# EAGLE design TestV1.0 (EAGLE 8.2.2)
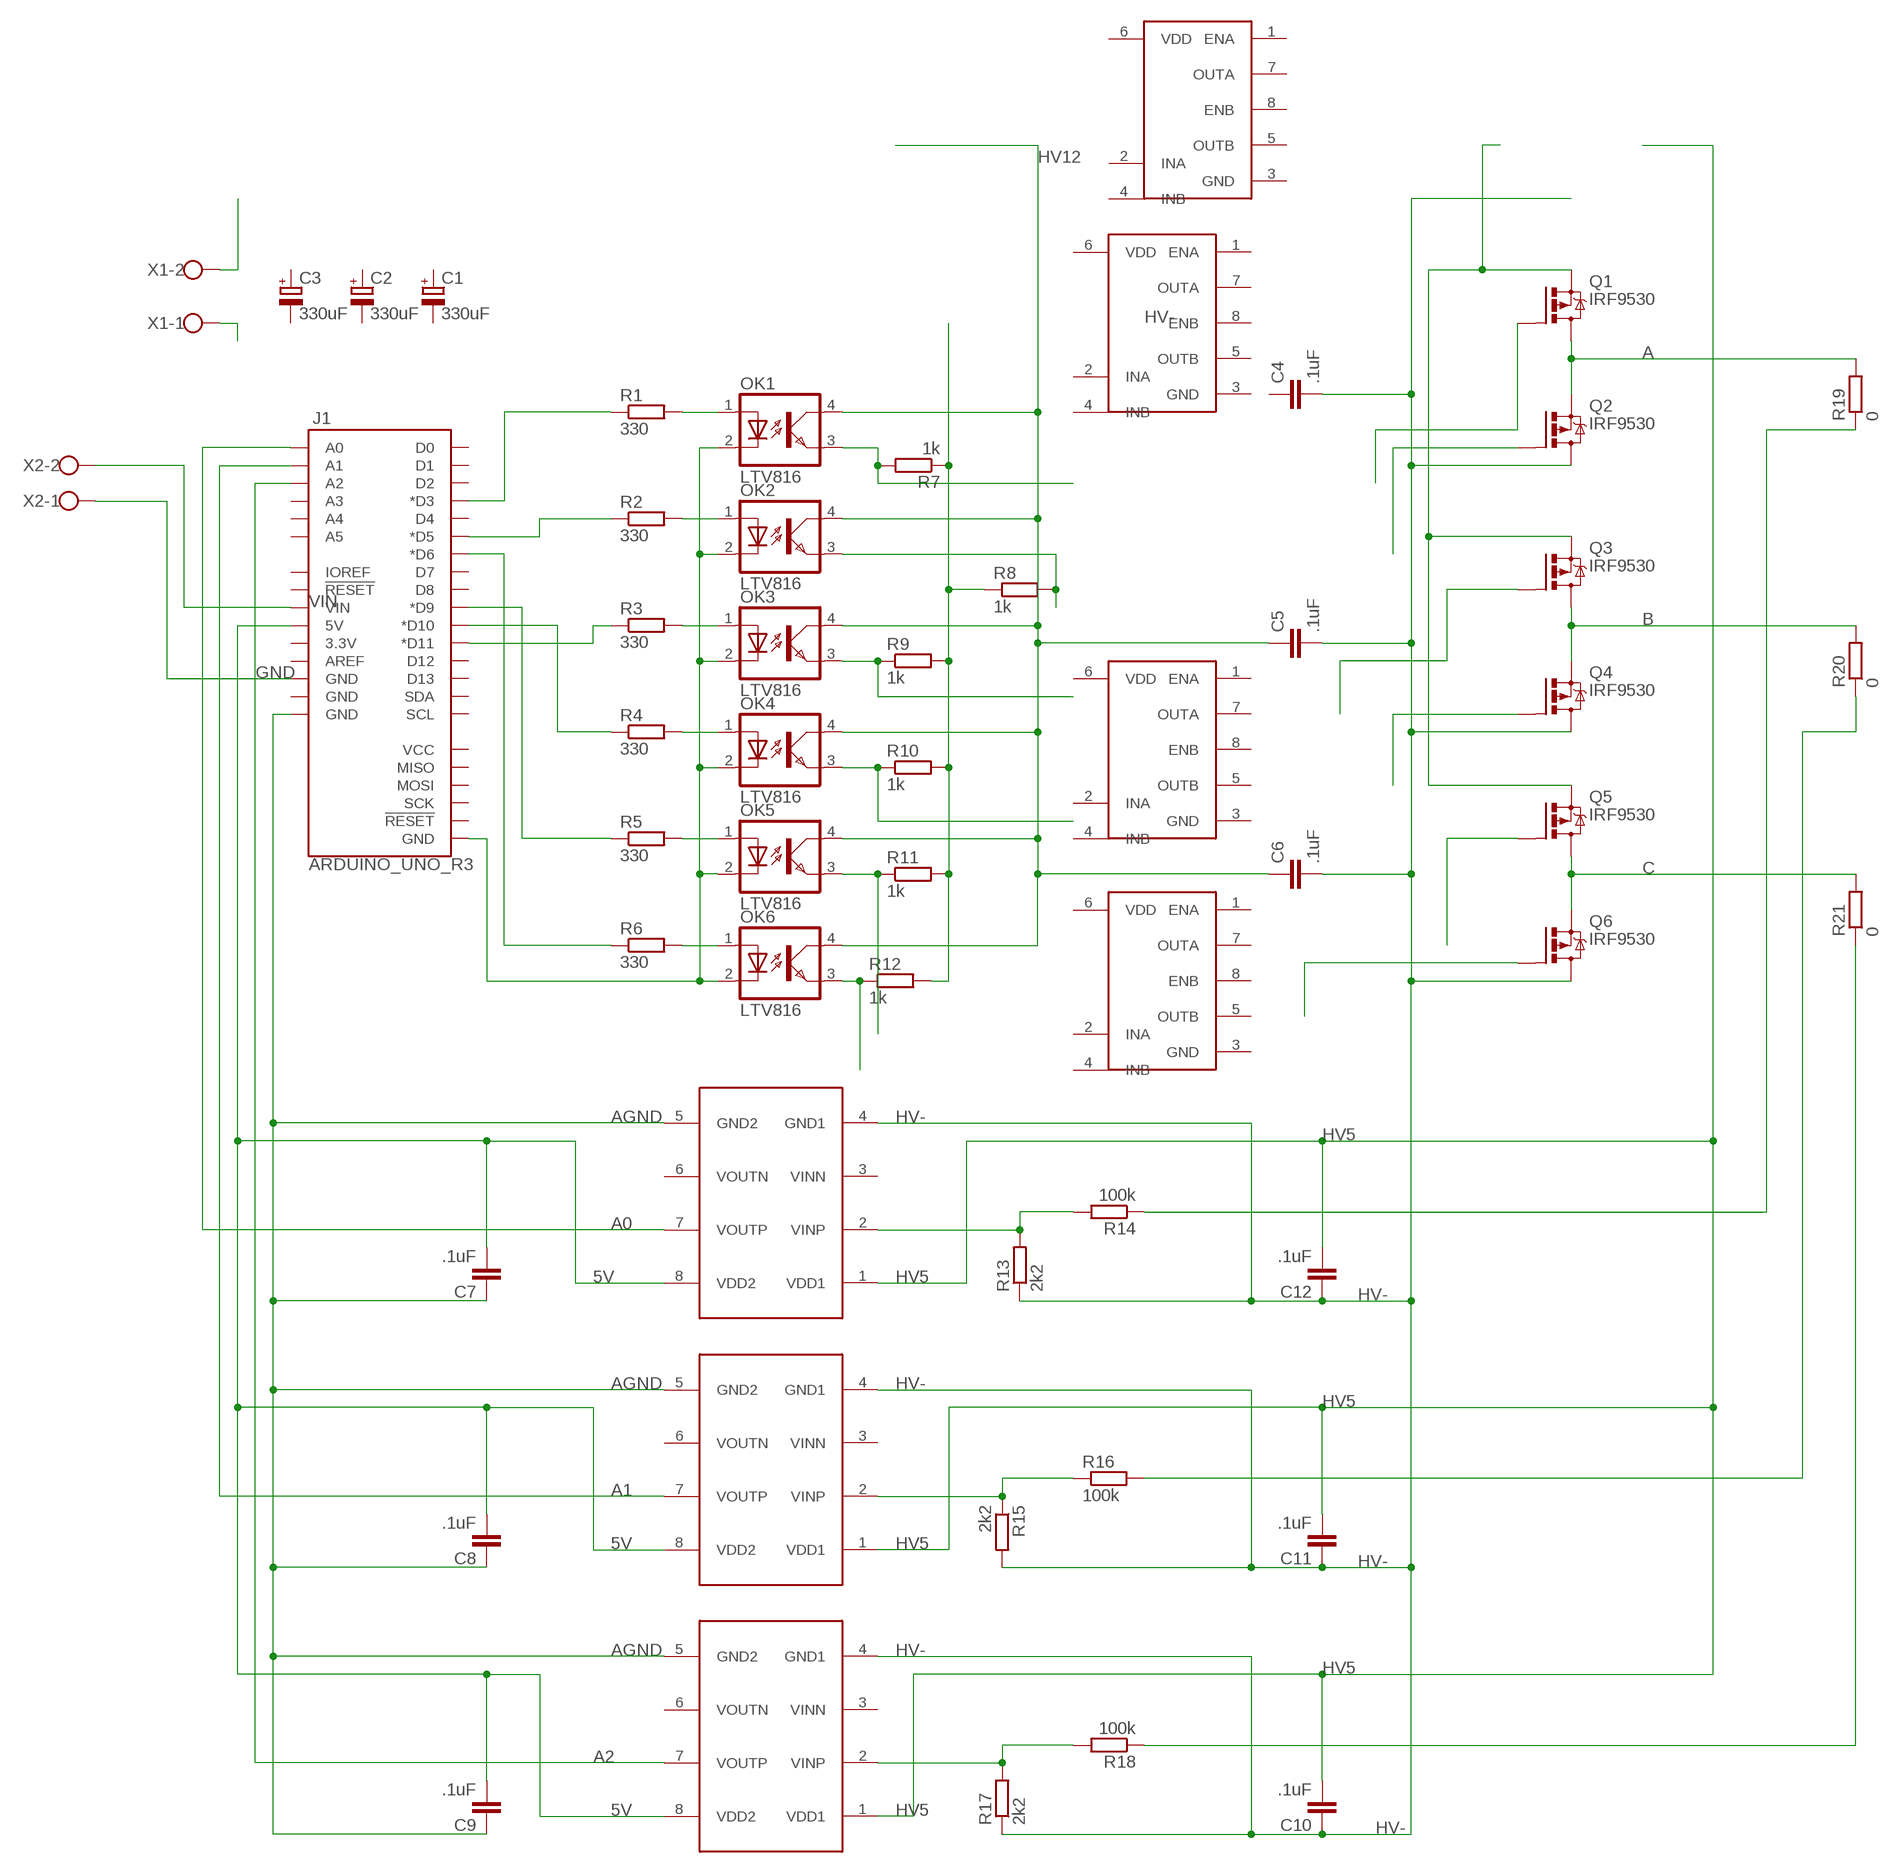
[diagram p0: schematic, sheet 1]

## Parts
C1  330uF  CPOL-EUE5-13  [E5-13]
C2  330uF  CPOL-EUE5-13  [E5-13]
C3  330uF  CPOL-EUE5-13  [E5-13]
C4  .1uF  C-EUC0603  [C0603]
C5  .1uF  C-EUC0603  [C0603]
C6  .1uF  C-EUC0603  [C0603]
C7  .1uF  C-EUC0603  [C0603]
C8  .1uF  C-EUC0603  [C0603]
C9  .1uF  C-EUC0603  [C0603]
C10  .1uF  C-EUC0603  [C0603]
C11  .1uF  C-EUC0603  [C0603]
C12  .1uF  C-EUC0603  [C0603]
J1  ARDUINO_UNO_R3  [ARDUINO_R3]
MAX17604_A  MAX17604  [SO08]
MAX17604_B  MAX17604  [SO08]
MAX17604_C  MAX17604  [SO08]
MAX17604_D  MAX17604  [SO08]
OK1  LTV816  [DIL04]
OK2  LTV816  [DIL04]
OK3  LTV816  [DIL04]
OK4  LTV816  [DIL04]
OK5  LTV816  [DIL04]
OK6  LTV816  [DIL04]
Q1  IRF9530  [TO220BV]
Q2  IRF9530  [TO220BV]
Q3  IRF9530  [TO220BV]
Q4  IRF9530  [TO220BV]
Q5  IRF9530  [TO220BV]
Q6  IRF9530  [TO220BV]
R1  330  RR0603  [R0603]
R2  330  RR0603  [R0603]
R3  330  RR0603  [R0603]
R4  330  RR0603  [R0603]
R5  330  RR0603  [R0603]
R6  330  RR0603  [R0603]
R7  1k  RR0603  [R0603]
R8  1k  RR0603  [R0603]
R9  1k  RR0603  [R0603]
R10  1k  RR0603  [R0603]
R11  1k  RR0603  [R0603]
R12  1k  RR0603  [R0603]
R13  2k2  RR0603  [R0603]
R14  100k  RR0603  [R0603]
R15  2k2  RR0603  [R0603]
R16  100k  RR0603  [R0603]
R17  2k2  RR0603  [R0603]
R18  100k  RR0603  [R0603]
R19  0  RR0603  [R0603]
R20  0  RR0603  [R0603]
R21  0  RR0603  [R0603]
U$7  AMC1200  [SO08]
U$8  AMC1200  [SO08]
U$9  AMC1200  [SO08]
X1  SCREWCONNECTOR  [2PIN-SCREW-TERMINAL]
X2  SCREWCONNECTOR  [2PIN-SCREW-TERMINAL]

## Nets
5V: C7.2 C8.2 C9.2 J1.5V U$7.8(VDD2) U$8.8(VDD2) U$9.8(VDD2)
A: Q1.D Q2.S R19.2
A0: J1.A0 U$7.7(VOUTP)
A1: J1.A1 U$8.7(VOUTP)
A2: J1.A2 U$9.7(VOUTP)
A_MINOR: R14.1 R19.1
AGND: C7.1 C8.1 C9.1 J1.GND@2(GND) U$7.5(GND2) U$8.5(GND2) U$9.5(GND2)
B: Q3.D Q4.S R20.2
B_MINOR: R16.2 R20.1
C: Q5.D Q6.S R21.2
C_MINOR: R18.1 R21.1
GND: J1.GND@4(GND) X2.1
HV5: C10.2 C11.2 C12.2 U$7.1(VDD1) U$8.1(VDD1) U$9.1(VDD1)
HV12: C5.1 C6.1 OK1.4(COL) OK2.4(COL) OK3.4(COL) OK4.4(COL) OK5.4(COL) OK6.4(COL)
HV+: Q1.S Q3.S Q5.S
HV-: C4.2 C5.2 C6.2 C10.1 C11.1 C12.1 Q2.D Q4.D Q6.D R13.1 R15.2 R17.1 U$7.4(GND1) U$8.4(GND1) U$9.4(GND1)
N$1: Q1.G
N$2: Q2.G
N$6: Q3.G
N$7: Q4.G
N$8: Q5.G
N$9: Q6.G
N$10: OK1.3(EMIT) R7.2
N$11: OK2.3(EMIT) R8.2
N$12: OK3.3(EMIT) R9.1
N$13: OK4.3(EMIT) R10.1
N$14: OK5.3(EMIT) R11.1
N$15: OK6.3(EMIT) R12.1
N$16: OK1.1(A) R1.2
N$17: J1.D3(*D3) R1.1
N$18: J1.GND@1(GND) OK1.2(C) OK2.2(C) OK3.2(C) OK4.2(C) OK5.2(C) OK6.2(C)
N$19: OK6.1(A) R6.2
N$20: OK5.1(A) R5.2
N$21: OK4.1(A) R4.2
N$22: OK3.1(A) R3.2
N$23: OK2.1(A) R2.2
N$24: J1.D5(*D5) R2.1
N$25: J1.D10(*D10) R4.1
N$26: J1.D11(*D11) R3.1
N$27: J1.D9(*D9) R5.1
N$28: J1.D6(*D6) R6.1
N$30: X1.2
N$31: R13.2 R14.2 U$7.2(VINP)
N$32: R15.1 R16.1 U$8.2(VINP)
N$33: R17.2 R18.2 U$9.2(VINP)
N$36: R7.1 R8.1 R9.2 R10.2 R11.2 R12.2
N$38: X1.1
VIN: J1.VIN X2.2
Unconnected: C1.+ C1.- C2.+ C2.- C3.+ C3.- C4.1 J1.3.3V J1.A3 J1.A4 J1.A5 J1.AREF J1.D0 J1.D1 J1.D2 J1.D4 J1.D7 J1.D8 J1.D12 J1.D13 J1.GND@3(GND) J1.IOREF J1.MISO J1.MOSI J1.RESET@1(!RESET!) J1.RESET@2(!RESET!) J1.SCK J1.SCL J1.SDA J1.VCC MAX17604_A.1(ENA) MAX17604_A.2(INA) MAX17604_A.3(GND) MAX17604_A.4(INB) MAX17604_A.5(OUTB) MAX17604_A.6(VDD) MAX17604_A.7(OUTA) MAX17604_A.8(ENB) MAX17604_B.1(ENA) MAX17604_B.2(INA) MAX17604_B.3(GND) MAX17604_B.4(INB) MAX17604_B.5(OUTB) MAX17604_B.6(VDD) MAX17604_B.7(OUTA) MAX17604_B.8(ENB) MAX17604_C.1(ENA) MAX17604_C.2(INA) MAX17604_C.3(GND) MAX17604_C.4(INB) MAX17604_C.5(OUTB) MAX17604_C.6(VDD) MAX17604_C.7(OUTA) MAX17604_C.8(ENB) MAX17604_D.1(ENA) MAX17604_D.2(INA) MAX17604_D.3(GND) MAX17604_D.4(INB) MAX17604_D.5(OUTB) MAX17604_D.6(VDD) MAX17604_D.7(OUTA) MAX17604_D.8(ENB) U$7.3(VINN) U$7.6(VOUTN) U$8.3(VINN) U$8.6(VOUTN) U$9.3(VINN) U$9.6(VOUTN)

## Library data of the parts
C1-C3 = rcl:CPOL-EU: POLARIZED CAPACITOR, European symbol
C4-C12 = resistor:C-EU: CAPACITOR, European symbol
J1 = ISCTRainingProgram:ARDUINO_UNO_R3: Arduino R3 Footprint (w/ SPI header)
MAX17604_A MAX17604_B MAX17604_C MAX17604_D = st-microelectronics:MAX17604: MAX17604 Dual MOSFET Driver
OK1-OK6 = optocoupler:LTV816: OPTO COUPLER Source: LITEON, LTV816.pdf; OC_FARNELL: unknown; OC_NEWARK: unknown
Q1-Q6 = transistor-power:IRF9530: P-CHANNEL HEXFET POWER-MOS-FET Source: http://www.irf.com/product-info/datasheets/data/irf9530.pdf
R1-R21 = eagle-ltspice:R: RESISTOR, European symbol; SPICEMODEL: NONE; SPICEPREFIX: R
U$7-U$9 = st-microelectronics:AMC1200
X1 X2 = ISCTRainingProgram:SCREWCONNECTOR: WAGO SCREW CLAMP; MPN: 237-102; OC_FARNELL: unknown; OC_NEWARK: 70K9898

## Net classes
0 default: width 0.508 mm, drill 0.508 mm, clearance 0.508 mm

## Board
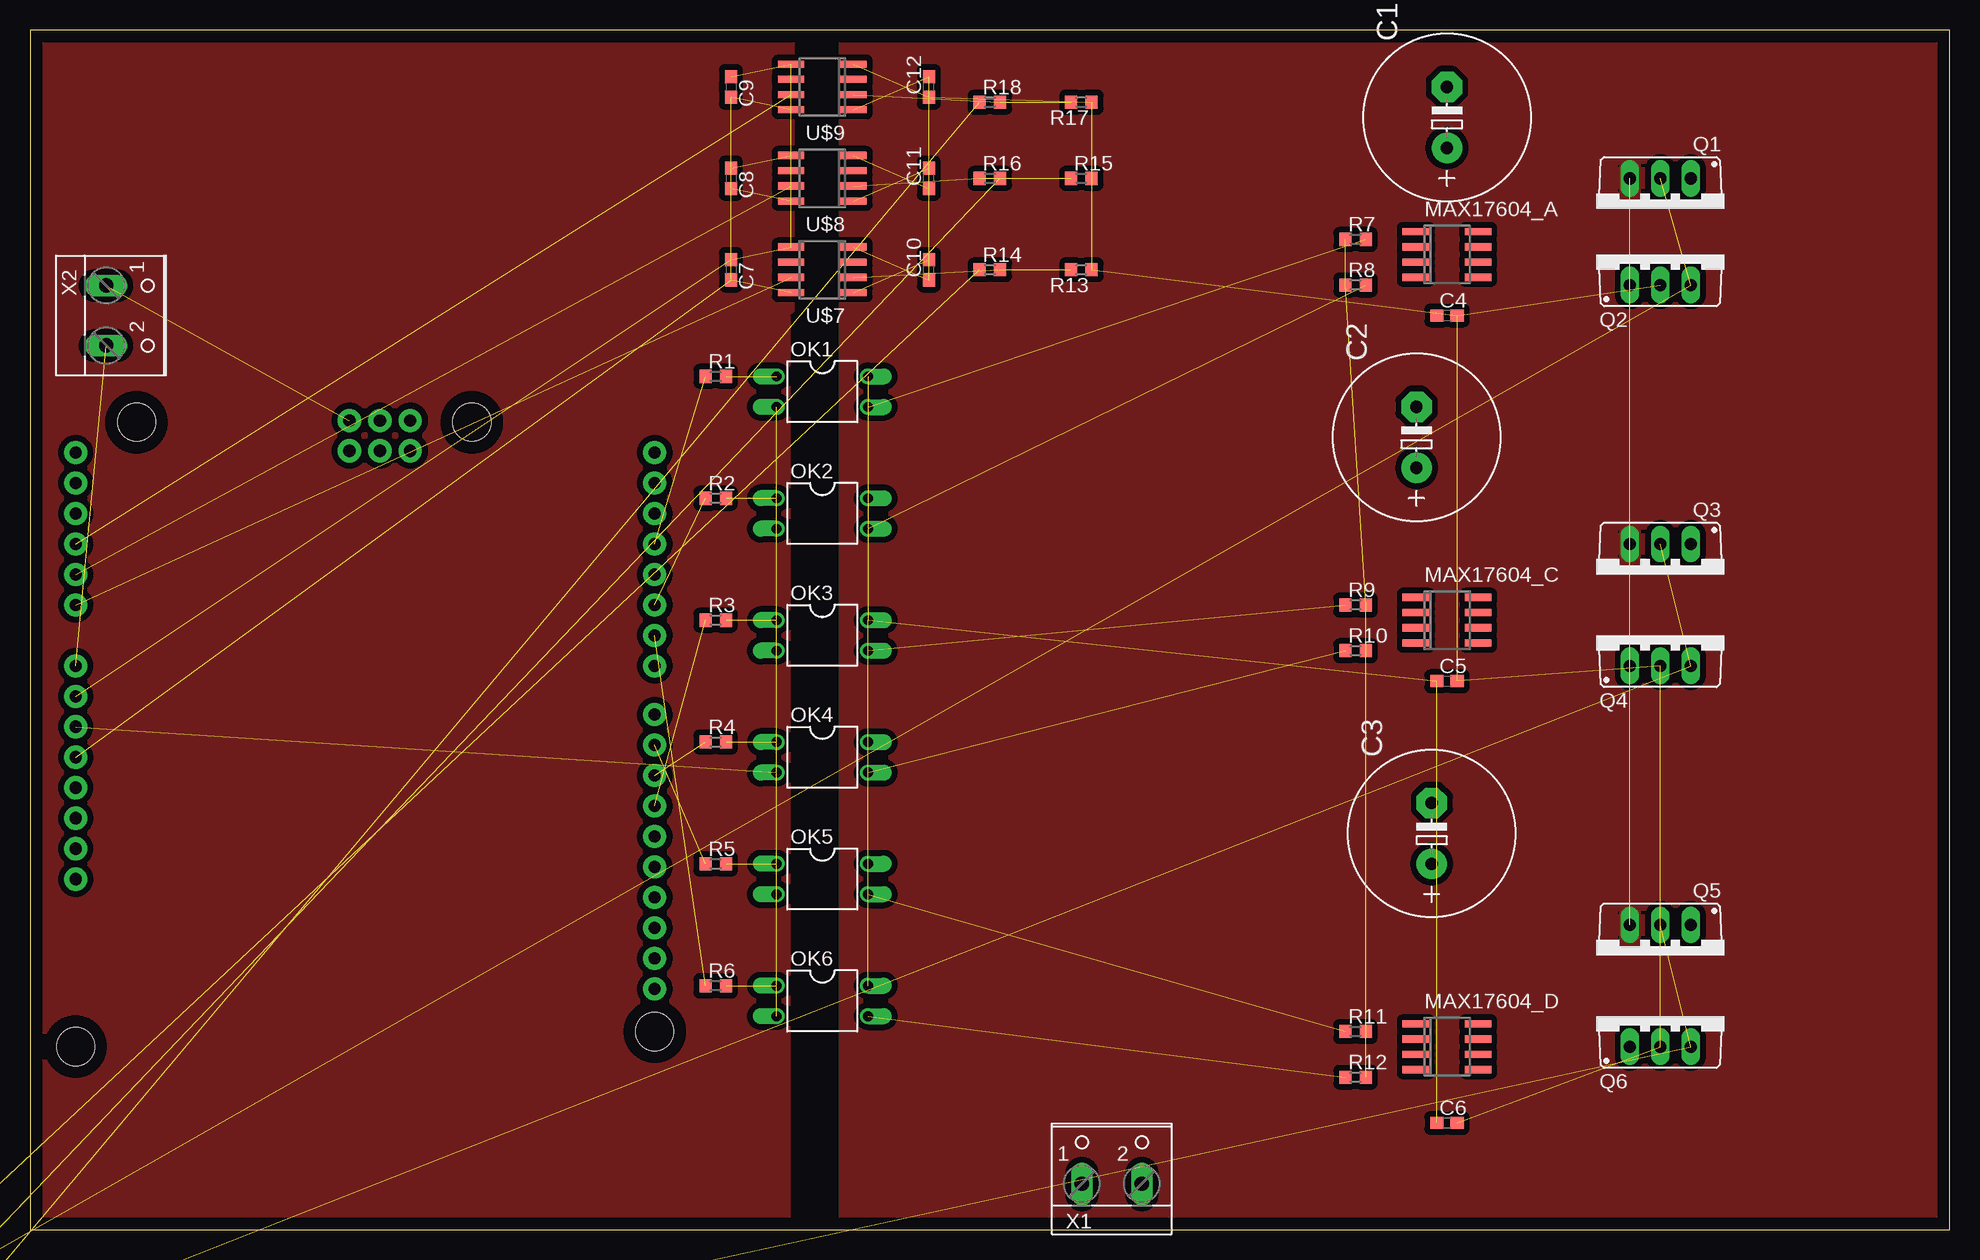
[diagram p1: board, top side]
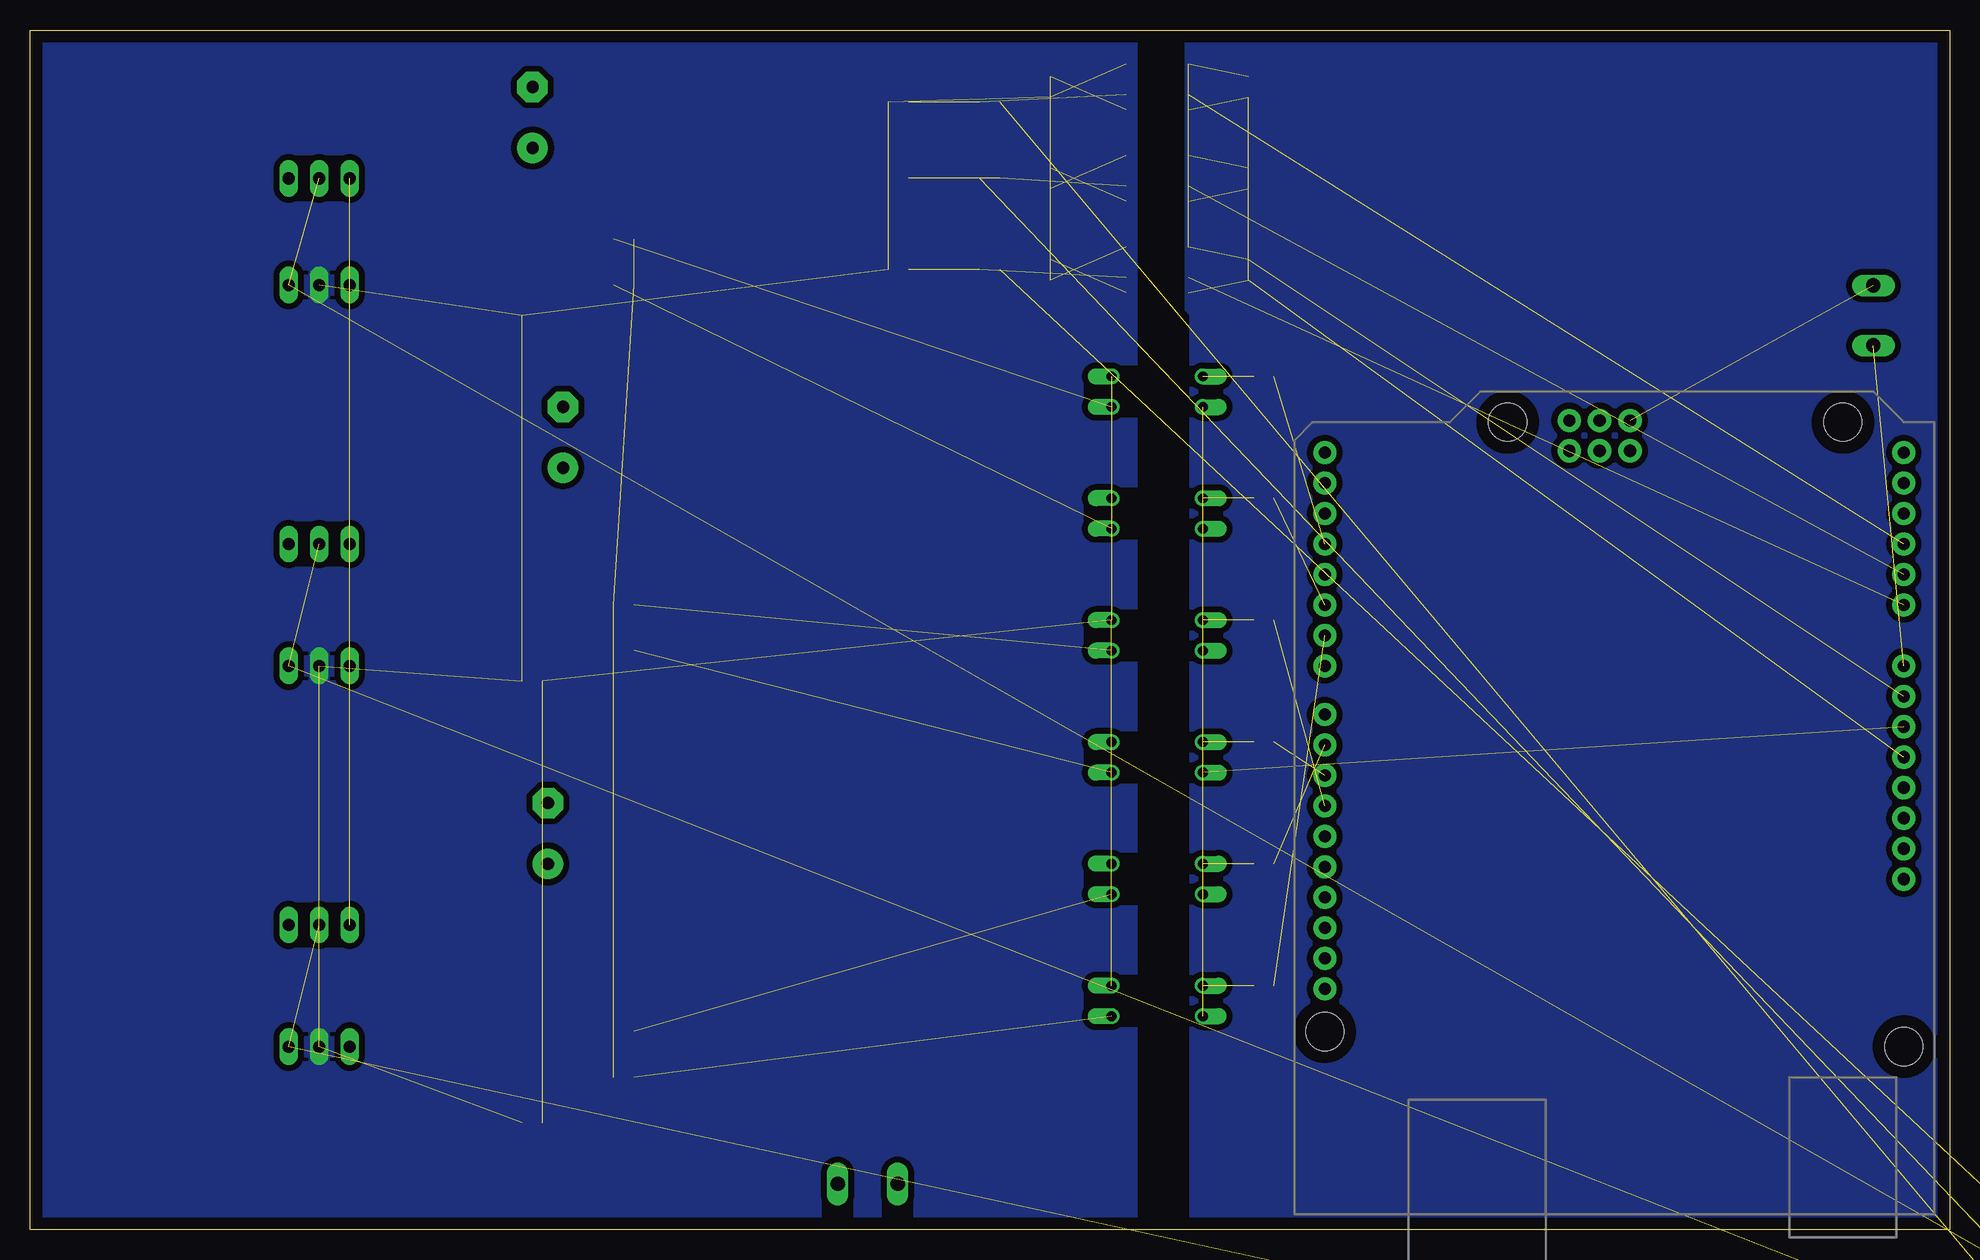
[diagram p2: board, bottom side, seen from below]

Size 160 x 100 mm. Coordinates in mm from the lower left corner, seen from the top.
Outline: 0,0 160,0 160,100 0,100 0,0
Copper layers (1*16): Top 0.035mm / dielectric 1.5mm / Bottom 0.035mm
Design rules "default": minimum track width 6mil, minimum drill 0.35mm, track to track 6mil, track to pad 6mil, pad to pad 6mil, via to via 6mil, smd to smd 6mil, copper to edge 40mil, drill to drill 6mil, minimum pad ring 10mil, minimum via ring 8mil, stop-mask expansion 4mil, vias tented up to drill 0mil, thermal gap 10mil
tRestrict: area 63.5,0 to 67.3,100.3
bRestrict: area 63.5,0 to 67.3,100.3

### Footprints (pad centres in the part's own frame; a part is rotated, then mirrored left to right if it is on the bottom)
E5-13 = drill 1.016 pad 2.54: + -2.54,0 | drill 1.016 pad 2.54 octagon: - 2.54,0
C0603 = smd 1.1 x 1: 1 -0.85,0; 2 0.85,0
ARDUINO_R3 = drill 1.016 pad 1.93: 3.3V 35.56,2.54; 5V 38.1,2.54; A0 50.8,2.54; A1 53.34,2.54; A2 55.88,2.54; A3 58.42,2.54; A4 60.96,2.54; A5 63.5,2.54; AREF 23.876,50.8; D0 63.5,50.8; D1 60.96,50.8; D2 58.42,50.8; D3 55.88,50.8; D4 53.34,50.8; D5 50.8,50.8; D6 48.26,50.8; D7 45.72,50.8; D8 41.656,50.8; D9 39.116,50.8; D10 36.576,50.8; D11 34.036,50.8; D12 31.496,50.8; D13 28.956,50.8; GND@1 40.64,2.54; GND@2 43.18,2.54; GND@3 26.416,50.8; GND@4 66.18,25.35; IOREF 30.48,2.54; MISO 63.64,30.43; MOSI 66.18,27.89; NC 27.94,2.54; RESET@1 33.02,2.54; RESET@2 63.64,25.35; SCK 63.64,27.89; SCL 18.796,50.8; SDA 21.336,50.8; VCC 66.18,30.43; VIN 45.72,2.54 | hole 3.175: 15.24,50.8; 66.04,35.56; 66.04,7.62; 13.97,2.54
SO08 = smd 0.6 x 2.2: 1 -1.905,-2.6; 2 -0.635,-2.6; 3 0.635,-2.6; 4 1.905,-2.6; 5 1.905,2.6; 6 0.635,2.6; 7 -0.635,2.6; 8 -1.905,2.6
DIL04 = drill 0.813 offset: 1 -1.27,-3.81; 2 1.27,-3.81; 3 1.27,3.81; 4 -1.27,3.81
TO220BV = drill 1.016 long: D 0,-2.54; G -2.54,-2.54; S 2.54,-2.54
R0603 = smd 1 x 1.1: 1 -0.85,0; 2 0.85,0
2PIN-SCREW-TERMINAL = drill 1.194 long: 1 -2.5,-1.27; 2 2.5,-1.27

### Placement (x,y rotation side)
C1  118.11,92.71 90 top
C2  115.57,66.04 90 top
C3  116.84,33.02 90 top
C4  118.11,76.2 0 top
C5  118.11,45.72 0 top
C6  118.11,8.89 0 top
C7  58.42,80.01 270 top
C8  58.42,87.63 270 top
C9  58.42,95.25 270 top
C10  74.93,80.01 90 top
C11  74.93,87.63 90 top
C12  74.93,95.25 90 top
J1  1.27,1.27 90 bottom
MAX17604_A  118.11,81.28 270 top
MAX17604_B  -11.43,1.27 0 top  (outside the outline)
MAX17604_C  118.11,50.8 270 top
MAX17604_D  118.11,15.24 270 top
OK1  66.04,69.85 270 top
OK2  66.04,59.69 270 top
OK3  66.04,49.53 270 top
OK4  66.04,39.37 270 top
OK5  66.04,29.21 270 top
OK6  66.04,19.05 270 top
Q1  135.89,85.09 180 top
Q2  135.89,81.28 0 top
Q3  135.89,54.61 180 top
Q4  135.89,49.53 0 top
Q5  135.89,22.86 180 top
Q6  135.89,17.78 0 top
R1  57.15,71.12 0 top
R2  57.15,60.96 0 top
R3  57.15,50.8 0 top
R4  57.15,40.64 0 top
R5  57.15,30.48 0 top
R6  57.15,20.32 0 top
R7  110.49,82.55 0 top
R8  110.49,78.74 0 top
R9  110.49,52.07 0 top
R10  110.49,48.26 0 top
R11  110.49,16.51 0 top
R12  110.49,12.7 0 top
R13  87.63,80.01 180 top
R14  80.01,80.01 0 top
R15  87.63,87.63 0 top
R16  80.01,87.63 0 top
R17  87.63,93.98 180 top
R18  80.01,93.98 0 top
R19  -13.97,-7.62 0 top  (outside the outline)
R20  -13.97,-12.7 0 top  (outside the outline)
R21  -13.97,-17.78 0 top  (outside the outline)
U$7  66.04,80.01 90 top
U$8  66.04,87.63 90 top
U$9  66.04,95.25 90 top
X1  90.17,5.08 0 top
X2  7.62,76.2 270 top

### Tracks (layer width: path | path; a pad name or v marks a point on that pad's centre or on a via)
5V  (6 unrouted)
A  (2 unrouted)
A0  (1 unrouted)
A1  (1 unrouted)
A2  (1 unrouted)
A_MINOR  (1 unrouted)
AGND  (6 unrouted)
B  (2 unrouted)
B_MINOR  (1 unrouted)
C  (2 unrouted)
C_MINOR  (1 unrouted)
GND  (1 unrouted)
HV5  (5 unrouted)
HV12  (7 unrouted)
HV+  (2 unrouted)
  pour Top: 68.58,99.06 160.02,99.06 160.02,0 68.58,0
HV-  (14 unrouted)
  pour Bottom: 160.02,99.06 68.58,99.06 68.58,0 160.02,0
N$10  (1 unrouted)
N$11  (1 unrouted)
N$12  (1 unrouted)
N$13  (1 unrouted)
N$14  (1 unrouted)
N$15  (1 unrouted)
N$16  (1 unrouted)
N$17  (1 unrouted)
N$18  (6 unrouted)
N$19  (1 unrouted)
N$20  (1 unrouted)
N$21  (1 unrouted)
N$22  (1 unrouted)
N$23  (1 unrouted)
N$24  (1 unrouted)
N$25  (1 unrouted)
N$26  (1 unrouted)
N$27  (1 unrouted)
N$28  (1 unrouted)
N$29
  pour Top: 67.31,99.06 67.31,1.27 143.51,1.27 143.51,99.06
N$31  (2 unrouted)
N$32  (2 unrouted)
N$33  (2 unrouted)
N$34
  pour Top: 0,0 63.5,0 63.5,100.33 0,100.33
N$35
  pour Bottom: 63.5,0 63.5,100.33 0,100.33 0,0
N$36  (5 unrouted)
N$37
  pour Top (rank 6): 67.31,99.06 67.31,1.27 147.32,1.27 147.32,99.06
VIN  (1 unrouted)